# EAGLE design bike_sensor (EAGLE 9.6.1)
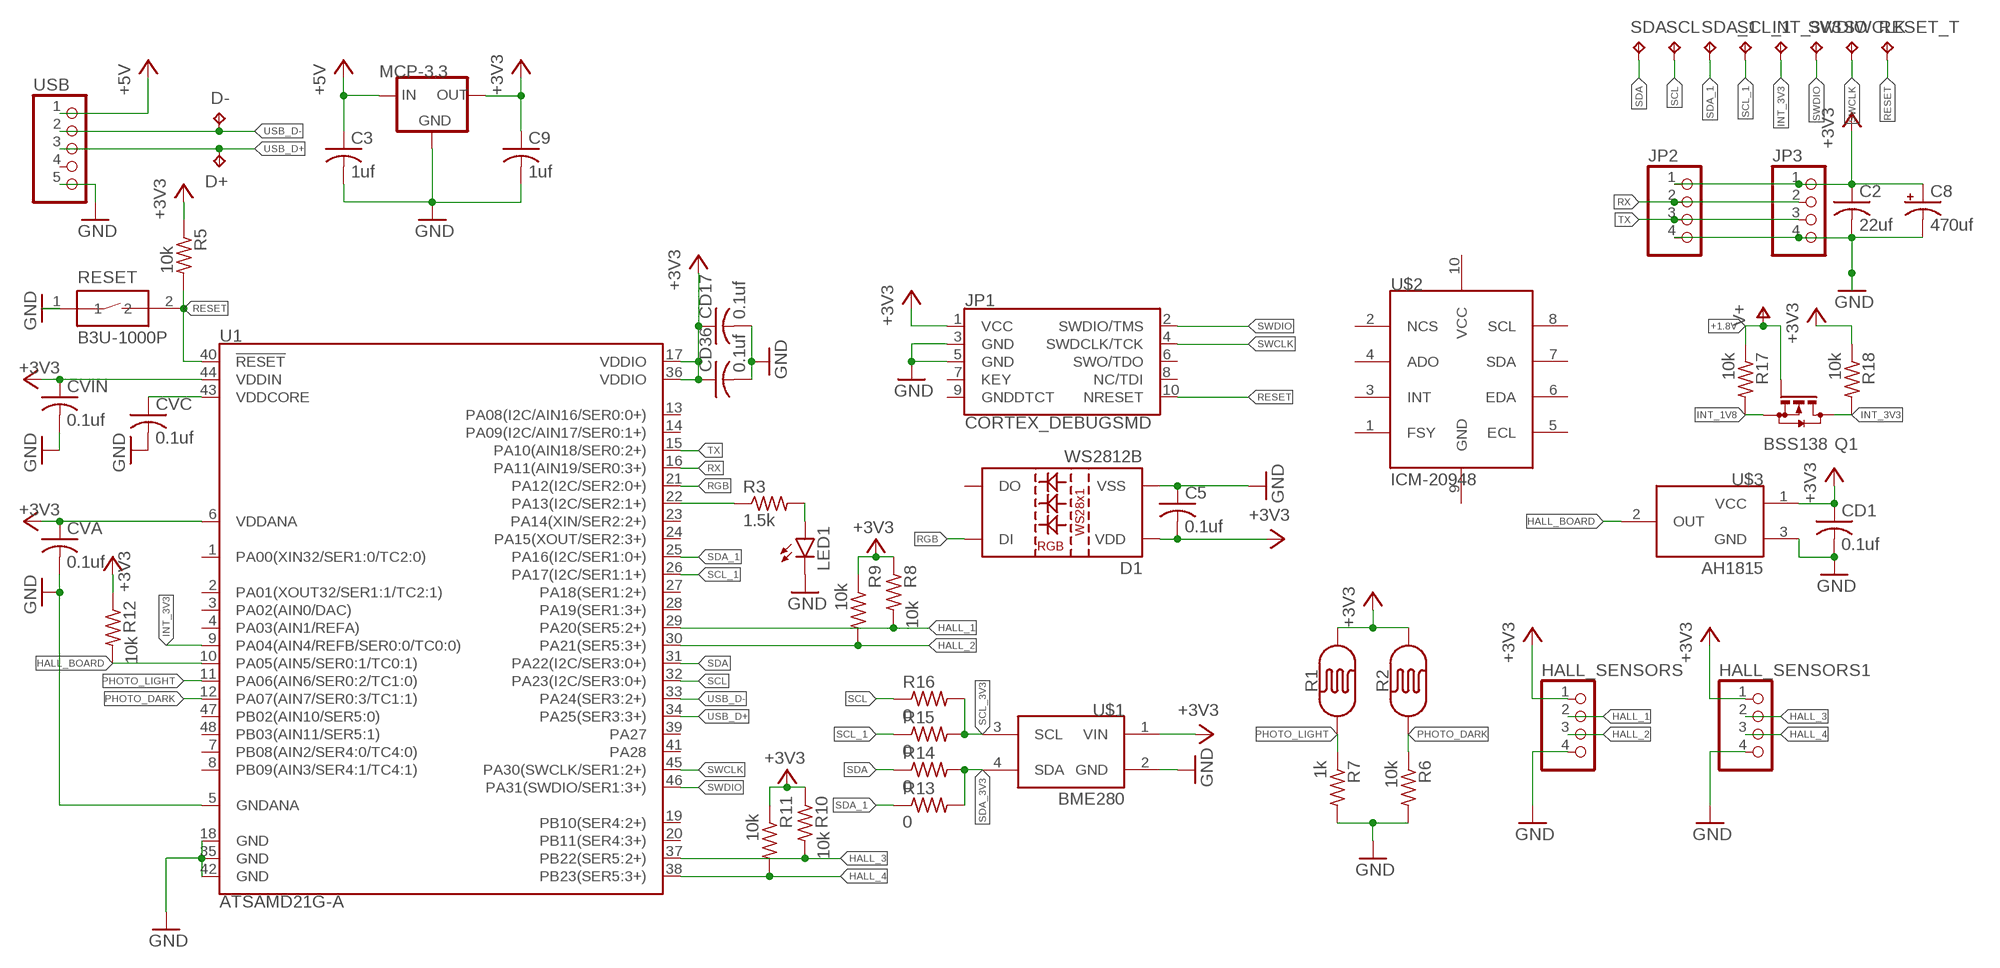
[diagram p0: schematic, sheet 1]

## Parts
C2  22uf  C-USC1210  [C1210]
C3  1uf  C-USC1210  [C1210]
C5  0.1uf  C-USC0805  [C0805]
C8  470uf  CPOL-USUD-8X10  [UD-8X10_NICHICON]
C9  1uf  C-USC1210  [C1210]
CD1  0.1uf  C-USC0805  [C0805]
CD17  0.1uf  C-USC0805  [C0805]
CD36  0.1uf  C-USC0805  [C0805]
CVA  0.1uf  C-USC0805  [C0805]
CVC  0.1uf  C-USC0805  [C0805]
CVIN  0.1uf  C-USC0805  [C0805]
D1  WS2812B  [WS2812B]
D+  TPB1,27  [B1,27]
D-  TPB1,27  [B1,27]
HALL_SENSORS  PINHD-1X4  [1X04]
HALL_SENSORS1  PINHD-1X4  [1X04]
INT_3V3  TPB1,27  [B1,27]
JP1  CORTEX_DEBUGSMD  [SAMTECH_FTSH-105-01]
JP2  PINHD-1X4  [1X04]
JP3  PINHD-1X4  [1X04]
LED1  LEDCHIPLED_0805  [CHIPLED_0805]
MCP-3.3  XC63FPM  [SOT23]
Q1  BSS138  BSS123  [SOT23]
R1  PHOTOCELLPTH  [PHOTOCELL]
R2  PHOTOCELLPTH  [PHOTOCELL]
R3  1.5k  R-US_R0805  [R0805]
R5  10k  R-US_R0805  [R0805]
R6  10k  R-US_R0805  [R0805]
R7  1k  R-US_R0805  [R0805]
R8  10k  R-US_R0805  [R0805]
R9  10k  R-US_R0805  [R0805]
R10  10k  R-US_R0805  [R0805]
R11  10k  R-US_R0805  [R0805]
R12  10k  R-US_R0805  [R0805]
R13  0  R-US_R0603  [R0603]
R14  0  R-US_R0603  [R0603]
R15  0  R-US_R0603  [R0603]
R16  0  R-US_R0603  [R0603]
R17  10k  R-US_R0805  [R0805]
R18  10k  R-US_R0805  [R0805]
RESET  B3U-1000P  [B3U-1000P]
RESET_T  TPB1,27  [B1,27]
SCL  TPB1,27  [B1,27]
SCL_1  TPB1,27  [B1,27]
SDA  TPB1,27  [B1,27]
SDA_1  TPB1,27  [B1,27]
SWCLK  TPB1,27  [B1,27]
SWDIO  TPB1,27  [B1,27]
U1  ATSAMD21G-A  [TQFP-48]
U$1  BMP280  [BME280-BOARD]
U$2  MPU9250  [ICM-20948-BOARD]
U$3  AH1815  [SOT23]
USB  PINHD-1X5  [1X05]

## Nets
+1.8V: Q1.1(G) R17.1 ; supply symbol labelled V+
+3V3: C2.1 C5.2 C8.+ C9.1 CD1.1 CD17.1 CD36.1 CVA.1 CVIN.1 D1.1(VDD) HALL_SENSORS1.1 HALL_SENSORS.1 JP1.1(VCC) JP2.1 JP3.1 MCP-3.3.2(OUT) R1.2 R2.2 R5.1 R8.1 R9.1 R10.1 R11.1 R12.1 R18.1 U1.6(VDDANA) U1.17(VDDIO) U1.36(VDDIO) U1.44(VDDIN) U$1.1(VIN) U$3.1(VCC)
+5V: C3.1 MCP-3.3.3(IN) USB.1
GND: C2.2 C3.2 C5.1 C8.- C9.2 CD1.2 CD17.2 CD36.2 CVA.2 CVC.2 CVIN.2 D1.3(VSS) HALL_SENSORS1.4 HALL_SENSORS.4 JP1.3(GND) JP1.5(GND) JP2.4 JP3.4 LED1.C MCP-3.3.1(GND) R6.2 R7.2 RESET.1 U1.5(GNDANA) U1.18(GND) U1.35(GND) U1.42(GND) U$1.2(GND) U$3.3(GND) USB.5
HALL_1: HALL_SENSORS.2 R8.2 U1.29(PA20(SER5:2+))
HALL_2: HALL_SENSORS.3 R9.2 U1.30(PA21(SER5:3+))
HALL_3: HALL_SENSORS1.2 R10.2 U1.37(PB22(SER5:2+))
HALL_4: HALL_SENSORS1.3 R11.2 U1.38(PB23(SER5:3+))
HALL_BOARD: R12.2 U1.10(PA05(AIN5/SER0:1/TC0:1)) U$3.2(OUT)
INT_1V8: Q1.2(S) R17.2
INT_3V3: INT_3V3.TP Q1.3(D) R18.2 U1.9(PA04(AIN4/REFB/SER0:0/TC0:0))
N$1: CVC.1 U1.43(VDDCORE)
N$2: R3.1 U1.22(PA13(I2C/SER2:1+))
N$3: LED1.A R3.2
PHOTO_DARK: R2.1 R6.1 U1.12(PA07(AIN7/SER0:3/TC1:1))
PHOTO_LIGHT: R1.1 R7.1 U1.11(PA06(AIN6/SER0:2/TC1:0))
RESET: JP1.10(NRESET) R5.2 RESET.2 RESET_T.TP U1.40(!RESET!)
RGB: D1.4(DI) U1.21(PA12(I2C/SER2:0+))
RX: JP2.2 JP3.2 U1.16(PA11(AIN19/SER0:3+))
SCL: R16.1 SCL.TP U1.32(PA23(I2C/SER3:0+))
SCL_1: R15.1 SCL_1.TP U1.26(PA17(I2C/SER1:1+))
SCL_3V3: R15.2 R16.2 U$1.3(SCL)
SDA: R14.1 SDA.TP U1.31(PA22(I2C/SER3:0+))
SDA_1: R13.1 SDA_1.TP U1.25(PA16(I2C/SER1:0+))
SDA_3V3: R13.2 R14.2 U$1.4(SDA)
SWCLK: JP1.4(SWDCLK/TCK) SWCLK.TP U1.45(PA30(SWCLK/SER1:2+))
SWDIO: JP1.2(SWDIO/TMS) SWDIO.TP U1.46(PA31(SWDIO/SER1:3+))
TX: JP2.3 JP3.3 U1.15(PA10(AIN18/SER0:2+))
USB_D+: D+.TP U1.34(PA25(SER3:3+)) USB.3
USB_D-: D-.TP U1.33(PA24(SER3:2+)) USB.2
Unconnected: D1.2(DO) JP1.6(SWO/TDO) JP1.7(KEY) JP1.8(NC/TDI) JP1.9(GNDDTCT) U1.1(PA00(XIN32/SER1:0/TC2:0)) U1.2(PA01(XOUT32/SER1:1/TC2:1)) U1.3(PA02(AIN0/DAC)) U1.4(PA03(AIN1/REFA)) U1.7(PB08(AIN2/SER4:0/TC4:0)) U1.8(PB09(AIN3/SER4:1/TC4:1)) U1.13(PA08(I2C/AIN16/SER0:0+)) U1.14(PA09(I2C/AIN17/SER0:1+)) U1.19(PB10(SER4:2+)) U1.20(PB11(SER4:3+)) U1.23(PA14(XIN/SER2:2+)) U1.24(PA15(XOUT/SER2:3+)) U1.27(PA18(SER1:2+)) U1.28(PA19(SER1:3+)) U1.39(PA27) U1.41(PA28) U1.47(PB02(AIN10/SER5:0)) U1.48(PB03(AIN11/SER5:1)) U$2.1(FSY) U$2.2(NCS) U$2.3(INT) U$2.4(ADO) U$2.5(ECL) U$2.6(EDA) U$2.7(SDA) U$2.8(SCL) U$2.9(GND) USB.4

## Power pins joined to a net without a drawn wire
VCC: U$2.10(VCC)

## Library data of the parts
C2 C3 C5 C9 CD1 CD17 CD36 CVA CVC CVIN = rcl:C-US: CAPACITOR, American symbol; SPICEPREFIX: C
C8 = rcl:CPOL-US: POLARIZED CAPACITOR, American symbol; SPICEPREFIX: C
D1 = SparkFun-LED:WS2812B: WS2812B SMD addressable RGB LED 5x5mm SMD LED with built-in controller IC. Color: Red/Green/Blue mC Rating: RGB: 390, 660, 180 mcd Forward Voltage: RGB: 2.0, 3.0, 3.0 V Packages:WS2812B SparkFun Products: Blynk Board - ESP8266 <https://www.sparkfun.com/products/13794>; PROD_ID: DIO-12503
D+ D- INT_3V3 RESET_T SCL SCL_1 SDA SDA_1 SWCLK SWDIO = testpad:TP: Test pad
HALL_SENSORS HALL_SENSORS1 JP2 JP3 = pinhead:PINHD-1X4: PIN HEADER
JP1 = CustomParts:CORTEX_DEBUG: Cortex Debug Connector Datasheet <http://infocenter.arm.com/help/topic/com.arm.doc.faqs/attached/13634/cortex_debug_connectors.pdf>
LED1 = led:LED: LED OSRAM: - CHIPLED LG R971, LG N971, LY N971, LG Q971, LY Q971, LO R971, LY R971 LH N974, LH R974 LS Q976, LO Q976, LY Q976 LO Q996 - Hyper CHIPLED LW Q18S LB Q993, LB Q99A, LB R99A - SideLED LS A670, LO A670, LY A670, LG A670, LP A670 LB A673, LV A673, LT A673, LW A673 LH A674 LY A675 LS A676, LA A676, LO A676, LY A676, LW A676 LS A679, LY A679, LG A679 - Hyper Micro SIDELED® LS Y876, LA Y876, LO Y876, LY Y876 LT Y87S - SmartLED LW L88C, LW L88S LB L89C, LB L89S, LG L890 LS L89K, LO L89K, LY L89K LS L896, LA L896, LO L896, LY L896 - TOPLED LS T670, LO T670, LY T670, LG T670, LP T670 LSG T670, LSP T670, LSY T670, LOP T670, LYG T670 LG T671, LOG T671, LSG T671 LB T673, LV T673, LT T673, LW T673 LH T674 LS T676, LA T676, LO T676, LY T676, LB T676, LH T676, LSB T676, LW T676 LB T67C, LV T67C, LT T67C, LS T67K, LO T67K, LY T67K, LW E67C LS E67B, LA E67B, LO E67B, LY E67B, LB E67C, LV E67C, LT E67C LW T67C LS T679, LY T679, LG T679 LS T770, LO T770, LY T770, LG T770, LP T770 LB T773, LV T773, LT T773, LW T773 LH T774 LS E675, LA E675, LY E675, LS T675 LS T776, LA T776, LO T776, LY T776, LB T776 LHGB T686 LT T68C, LB T68C - Hyper Mini TOPLED® LB M676 - Mini TOPLED Santana® LG M470 LS M47K, LO M47K, LY M47K Source: http://www.osram.convergy.de LUXEON: - LUMILED® LXK2-PW12-R00, LXK2-PW12-S00, LXK2-PW14-U00, LXK2-PW14-V00 LXK2-PM12-R00, LXK2-PM12-S00, LXK2-PM14-U00 LXK2-PE12-Q00, LXK2-PE12-R00, LXK2-PE12-S00, LXK2-PE14-T00, LXK2-PE14-U00 LXK2-PB12-K00, LXK2-PB12-L00, LXK2-PB12-M00, LXK2-PB14-N00, LXK2-PB14-P00, LXK2-PB14-Q00 LXK2-PR12-L00, LXK2-PR12-M00, LXK2-PR14-Q00, LXK2-PR14-R00 LXK2-PD12-Q00, LXK2-PD12-R00, LXK2-PD12-S00 LXK2-PH12-R00, LXK2-PH12-S00 LXK2-PL12-P00, LXK2-PL12-Q00, LXK2-PL12-R00 Source: www.luxeon.com KINGBRIGHT: KA-3528ASYC Source: www.kingbright.com
MCP-3.3 = v-reg:XC63FP: Positiv Voltage Regulators www.torex.co.jp/english/product/pro02/pdf/0201_xc62fp.pdf
Q1 = transistor-small-signal:BSS123: N-CHANNEL MOS FET
R1 R2 = SparkFun-Sensors:PHOTOCELL: Photocell (Photodetector, Photo Resistor, CdS) This is a very small light sensor. A photocell changes (also called a photodetector, photo resistor, CdS or photoconductive cell) resistance depending on the amount of light it is exposed to. These little sensors make great ambient light triggers (when light in the room turns on, do something). Datasheet <http://cdn.sparkfun.com/datasheets/Sensors/LightImaging/SEN-09088.pdf> SparkFun Products Mini Photocell <https://www.sparkfun.com/products/9088> (SEN-09088); PROD_ID: COMP-09129; SF_ID: SEN-09088
R3 R5-R18 = rcl:R-US_: RESISTOR, American symbol; SPICEPREFIX: R
RESET = Switch:B3U-1000P: SWITCH TACTILE SPST-NO 0.05A 12V Manufacturer's datasheet <https://omronfs.omron.com/en_US/ecb/products/pdf/en-b3u.pdf>; CREATED_BY: PCBLayout.com; DIGI_KEY_PART_NUMBER: SW1020CT-ND; MANUFACTURER: Omron Electronics Inc-EMC Div; MPN: B3U-1000P; PACKAGE: SPST-NO
U1 = CustomParts:ATSAMD21G: Atmel SAMD21G SMART ARM-Based Microcontroller The Atmel ® | SMART ™ SAM D21 is a series of low-power microcontrollers using the 32-bit ARM ® Cortex ® -M0+ processor, and ranging from 32- to 64-pins with up to 256KB Flash and 32KB of SRAM. The SAM D21 devices operate at a maximum frequency of 48MHz and reach 2.46 CoreMark/MHz. They are designed for simple and intuitive migration with identical peripheral modules, hex compatible code, identical linear address map and pin compatible migration paths between all devices in the product series. All devices include intelligent and flexible peripherals, Atmel Event System for inter-peripheral signaling, and support for capacitive touch button, slider and wheel user interfaces.; PROD_ID: IC-13064
U$1 = CustomParts:BMP280
U$2 = CustomParts:MPU9250
U$3 = CustomParts:AH1815: Hall sensor AH1815 Non-latching
USB = pinhead:PINHD-1X5: PIN HEADER

## Board
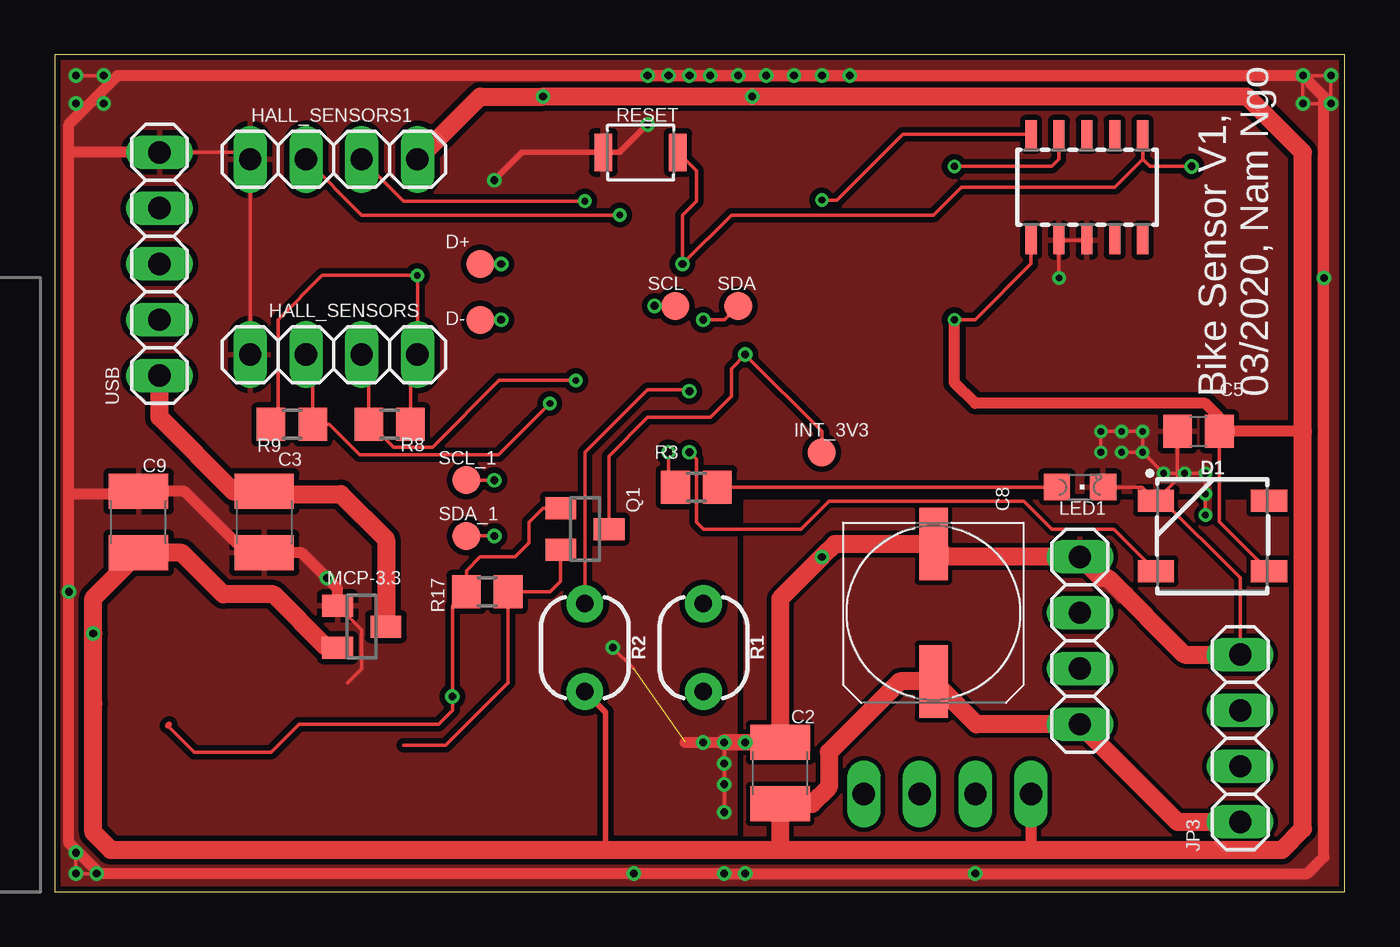
[diagram p1: board, top side]
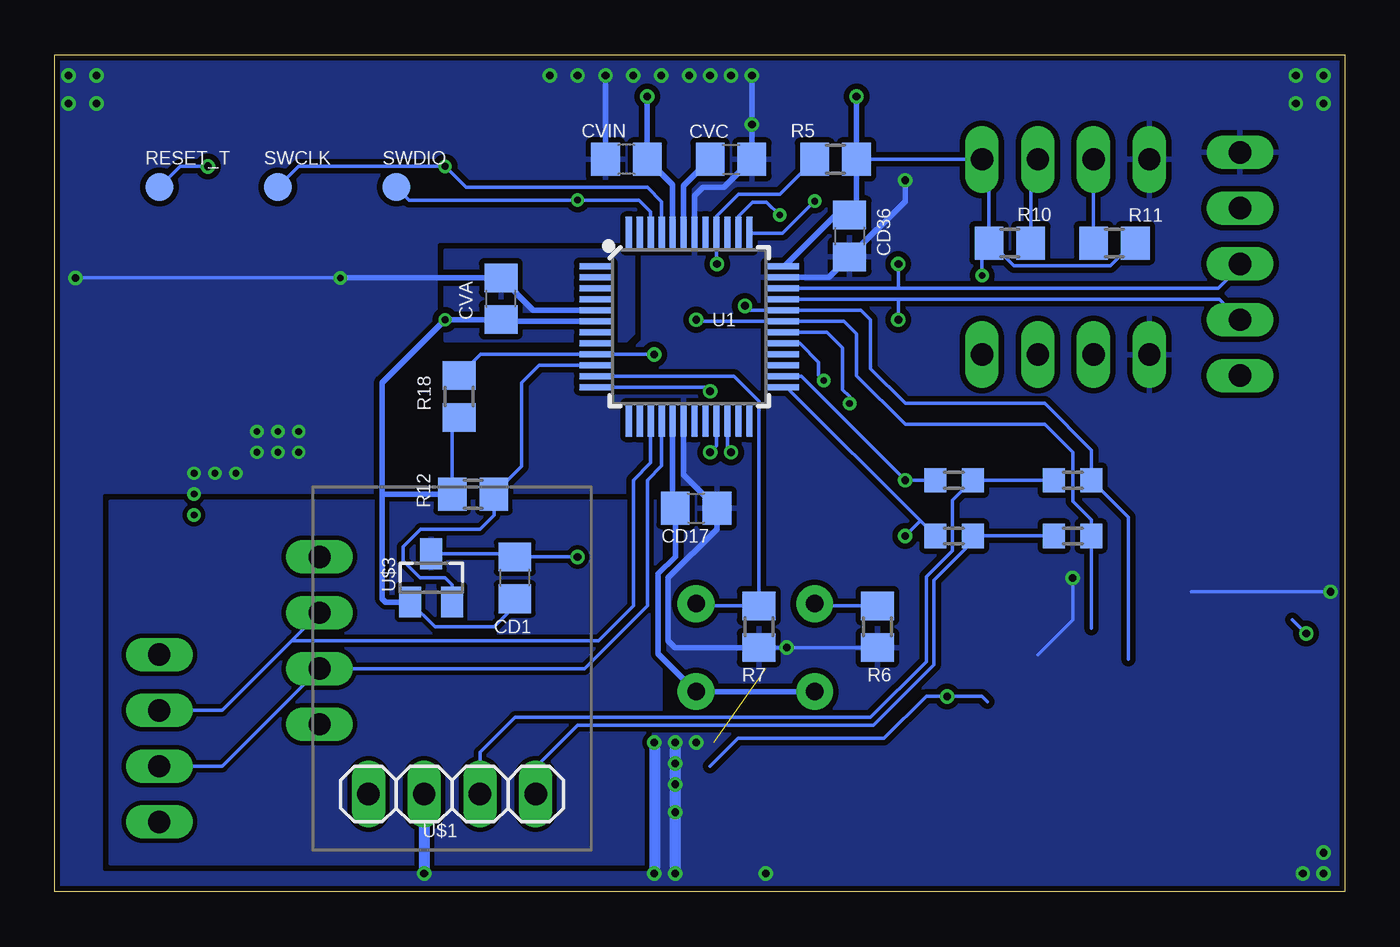
[diagram p2: board, bottom side, seen from below]

Size 58.73 x 38.09 mm. Coordinates in mm from the lower left corner, seen from the top.
Outline: 0,0 58.73,0 58.73,38.09 0,38.09 0,0
Copper layers (1*16): Top 0.035mm / dielectric 1.5mm / Bottom 0.035mm
Design rules "dirt_cheap_dirty_boards.v1.1": minimum track width 6mil, minimum drill 12mil, track to track 6mil, track to pad 6mil, pad to pad 6mil, via to via 6mil, smd to smd 0mil, copper to edge 10mil, drill to drill 10mil, minimum pad ring 10mil, minimum via ring 6mil, stop-mask expansion 2mil, vias tented up to drill 25mil, thermal gap 10mil

### Footprints (pad centres in the part's own frame; a part is rotated, then mirrored left to right if it is on the bottom)
C1210 = smd 1.6 x 2.7: 1 -1.4,0; 2 1.4,0
C0805 = smd 1.3 x 1.5: 1 -0.95,0; 2 0.95,0
UD-8X10_NICHICON = smd 3.3 x 1.3: + 3.125,0; - -3.125,0
WS2812B = smd 1.651 x 1: 1 2.577,-1.6; 2 2.577,1.6; 3 -2.577,1.6; 4 -2.577,-1.6
B1,27 = smd 1.27 x 1.27: TP 0,0
1X04 = drill 1.016 long: 1 -3.81,0; 2 -1.27,0; 3 1.27,0; 4 3.81,0
SAMTECH_FTSH-105-01 = smd 0.508 x 1.27: 1 -2.54,-2.413; 2 -2.54,2.413; 3 -1.27,-2.413; 4 -1.27,2.413; 5 0,-2.413; 6 0,2.413; 7 1.27,-2.413; 8 1.27,2.413; 9 2.54,-2.413; 10 2.54,2.413
CHIPLED_0805 = smd 1.2 x 1.2: A 0,-1.05; C 0,1.05
SOT23 = smd 1 x 1.4: 1 -0.95,-1.1; 2 0.95,-1.1; 3 0,1.1
PHOTOCELL = drill 0.8 pad 1.676: 1 -2,0; 2 2,0
R0805 = smd 1.3 x 1.5: 1 -0.95,0; 2 0.95,0
R0603 = smd 1 x 1.1: 1 -0.85,0; 2 0.85,0
B3U-1000P = smd 0.8 x 1.7: 1 -1.7,0; 2 1.7,0
TQFP-48 = smd 1.5 x 0.28: 1 -4.25,2.75; 2 -4.25,2.25; 3 -4.25,1.75; 4 -4.25,1.25; 5 -4.25,0.75; 6 -4.25,0.25; 7 -4.25,-0.25; 8 -4.25,-0.75; 9 -4.25,-1.25; 10 -4.25,-1.75; 11 -4.25,-2.25; 12 -4.25,-2.75; 25 4.25,-2.75; 26 4.25,-2.25; 27 4.25,-1.75; 28 4.25,-1.25; 29 4.25,-0.75; 30 4.25,-0.25; 31 4.25,0.25; 32 4.25,0.75; 33 4.25,1.25; 34 4.25,1.75; 35 4.25,2.25; 36 4.25,2.75 | smd 0.28 x 1.5: 13 -2.75,-4.25; 14 -2.25,-4.25; 15 -1.75,-4.25; 16 -1.25,-4.25; 17 -0.75,-4.25; 18 -0.25,-4.25; 19 0.25,-4.25; 20 0.75,-4.25; 21 1.25,-4.25; 22 1.75,-4.25; 23 2.25,-4.25; 24 2.75,-4.25; 37 2.75,4.25; 38 2.25,4.25; 39 1.75,4.25; 40 1.25,4.25; 41 0.75,4.25; 42 0.25,4.25; 43 -0.25,4.25; 44 -0.75,4.25; 45 -1.25,4.25; 46 -1.75,4.25; 47 -2.25,4.25; 48 -2.75,4.25
BME280-BOARD = drill 1.016 long: 1 -6.35,3.81; 2 -6.35,1.27; 3 -6.35,-1.27; 4 -6.35,-3.81
ICM-20948-BOARD = drill 1.016 long: 1 0,-11.43; 2 0,-8.89; 3 0,-6.35; 4 0,-3.81; 5 0,-1.27; 6 0,1.27; 7 0,3.81; 8 0,6.35; 9 0,8.89; 10 0,11.43
1X05 = drill 1.016 long: 1 -5.08,0; 2 -2.54,0; 3 0,0; 4 2.54,0; 5 5.08,0

### Placement (x,y rotation side)
C2  33.02,5.4 90 top
C3  9.53,16.83 270 top
C5  52.07,20.96 0 top
C8  40.01,12.7 270 top
C9  3.81,16.83 90 top
CD1  37.78,14.29 90 bottom
CD17  29.53,17.46 0 bottom
CD36  22.54,29.85 270 bottom
CVA  38.42,26.99 90 bottom
CVC  27.94,33.34 0 bottom
CVIN  32.7,33.34 180 bottom
D1  52.7,16.19 0 top
D+  19.37,28.57 0 top
D-  19.37,26.04 0 top
HALL_SENSORS  12.7,24.45 180 top
HALL_SENSORS1  12.7,33.34 180 top
INT_3V3  34.93,20 0 top
JP1  46.99,32.07 0 top
JP2  46.67,11.43 90 top
JP3  53.98,6.98 90 top
LED1  46.67,18.42 270 top
MCP-3.3  13.97,12.07 270 top
Q1  24.13,16.51 270 top
R1  29.53,11.11 270 top
R2  24.13,11.11 270 top
R3  29.21,18.42 0 top
R5  23.18,33.34 180 bottom
R6  21.27,12.07 270 bottom
R7  26.67,12.07 270 bottom
R8  15.24,21.27 180 top
R9  10.79,21.27 0 top
R10  15.24,29.53 0 bottom
R11  10.48,29.53 180 bottom
R12  39.69,18.1 0 bottom
R13  17.78,16.19 0 bottom
R14  12.38,16.19 180 bottom
R15  17.78,18.73 0 bottom
R16  12.38,18.73 180 bottom
R17  19.69,13.65 0 top
R18  40.32,22.54 90 bottom
RESET  26.67,33.66 0 top
RESET_T  53.98,32.07 0 bottom
SCL  28.26,26.67 0 top
SCL_1  18.73,18.73 0 top
SDA  31.12,26.67 0 top
SDA_1  18.73,16.19 0 top
SWCLK  48.58,32.07 0 bottom
SWDIO  43.18,32.07 0 bottom
U1  29.85,25.72 0 bottom
U$1  40.64,10.79 90 bottom
U$2  -14.61,13.97 0 top  (outside the outline)
U$3  41.59,14.29 0 bottom
USB  4.76,28.57 90 top

### Tracks (layer width: path | path; a pad name or v marks a point on that pad's centre or on a via)
+1.8V  (via drill 0.35)
  Top 0.152: 5.15,7.55 6.35,6.35 9.84,6.35 11.11,7.62 17.46,7.62 18.1,8.25 v18.1,8.89 18.1,13.02 R17.1 18.73,14.61 19.37,15.24 20.96,15.24 21.59,15.87 21.59,16.83 22.22,17.46 Q1.1
  Top 0.254: 5.21,7.62 5.15,7.55
  Bottom 0.152: 28.89,5.71 27.63,6.98 20.96,6.98 19.05,8.89 v18.1,8.89 16.51,8.89 16.26,8.64
+3V3  (via drill 0.3, 0.35)
  Top 0.152: R8.1 16.19,24.13 HALL_SENSORS.1 v16.51,28.05 12.18,28.05 10.16,26.04 10.16,21.59 R9.1 | C5.2 53.02,16.85 D1.1 | v40.96,26.04 41.91,26.04 44.45,28.57 JP1.1
  Top 0.254: R2.2 25.08,8.16 25.08,1.91
  Top 0.508: MCP-3.3.2 12.38,11.11 | U$1.1 44.45,1.91 | 56.83,20.96 C5.2 | C5.2 53.02,21.59 52.39,22.22 41.91,22.22 40.96,23.18 v40.96,26.04
  Top 0.813: JP3.1 51.12,3.18 JP2.1 41.96,7.62 C8.+ 38.47,9.57 35.24,6.35 35.24,4.76 34.48,4 C2.1 33.02,1.91 | HALL_SENSORS1.1 19.37,36.19 v22.23,36.19 v31.75,36.19 54.29,36.19 56.83,33.65 56.83,20.96 56.83,2.86 55.88,1.91 44.45,1.91 33.02,1.91 | 33.02,1.91 25.08,1.91 2.54,1.91 1.75,2.7 1.75,8.57 v1.75,11.75 1.75,13.36 C9.1 5.78,15.43 7.67,13.54 9.96,13.54 12.38,11.11
  Bottom 0.152: 38.35,25.97 CVA.1 | U1.36 25.51,28.47 | U$3.1 41.42,12.07 38.73,12.07 37.78,13.02 CD1.1 | 22.23,31.11 CD36.1 | R10.1 16.19,33.02 HALL_SENSORS1.1 R5.1 | R11.1 9.63,29.53 10.66,28.5 15.06,28.5 16.09,29.53 R10.1 | v16.51,28.05 16.51,29.21 R10.1 | v1.75,11.75 2.38,12.38 | R12.1 40.64,21.28 R18.1
  Bottom 0.254: U1.17 30.6,17.58 CD17.1 30.48,15.25 31.26,14.48 31.26,10.84 R1.2 R2.2 | U1.6 38.35,25.97 | CD36.1 23.18,30.79 25.51,28.47 | U1.44 30.6,32.18 CVIN.1 v31.75,36.19 | 43.81,18.1 43.81,13.34 43.67,13.19 U$3.1 | CVA.1 v40.96,26.04 43.81,23.18 43.81,18.1 | R12.1 43.81,18.1 | 22.23,31.11 R5.1 v22.23,36.19
+5V
  Top 0.508: C3.1 9.65,18.1
  Top 0.813: 9.65,18.1 13.02,18.1 15.07,16.04 MCP-3.3.3 | USB.1 4.76,21.59 8.12,18.23 C3.1
AGND
  pour Bottom (isolate 0.254): 32.38,29.21 40.96,29.21 40.96,25.08 32.7,25.08 32.38,25.4
GND  (via drill 0.3, 0.35)  (1 unrouted)
  Top 0.152: HALL_SENSORS.4 HALL_SENSORS1.4 8.57,33.65 USB.5 | C5.1 51.12,19.05 | 51.12,19.05 51.12,18.78 50.3,17.96 | 50.3,17.96 D1.3 49.51,18.42 LED1.C | JP3.4 53.98,14.29 50.3,17.96 | v45.72,27.94 JP1.3 JP1.5 | MCP-3.3.1 13.97,11.91 13.97,10.16 13.33,9.52 | v32.38,37.15 v31.12,37.15 | v36.2,37.15 v34.93,37.15 | v1.91,0.83 v0.95,0.83 v0.95,1.78 0.64,2.1 0.64,2.22 | v56.83,37.15 v56.83,35.88 v58.1,35.88 v58.1,37.15 v56.83,37.15 | v56.83,37.15 57.15,36.83 | v0.95,37.15 v2.22,37.15 2.22,36.51 v2.22,35.88 v0.95,35.88 | v47.62,20 v47.62,20.96 v48.58,20.96 v49.53,20.96 v49.53,20 | v49.53,20 v48.58,20 | v49.53,20 v50.48,19.05 51.12,19.05 | 51.12,19.05 v51.44,19.05 v52.39,19.05 v52.39,18.1 v52.39,17.14 | v30.48,6.79 30.48,6.67 | 30.48,6.67 v30.48,5.84 v30.48,4.89 v30.48,3.62 | v29.53,6.79 30.35,6.79 30.48,6.67 | v25.4,11.11 26.35,10.16
  Top 0.254: v26.99,34.93 25.72,33.65 RESET.1 21.27,33.65 v20,32.39
  Top 0.508: 57.15,36.83 57.79,36.19 v57.79,27.94 57.79,1.59 57.02,0.83 v41.91,0.83 v31.43,0.83 v30.48,0.83 v26.35,0.83 2.03,0.83 0.64,2.22 v0.64,13.65 0.64,18.1 | v56.83,37.15 v34.93,37.15 v33.66,37.15 v31.12,37.15 v29.85,37.15 v28.89,37.15 v27.94,37.15 v26.99,37.15 2.86,37.15 2.22,36.51 0.64,34.93 0.64,33.65 | v30.48,6.79 v30.48,6.8 28.71,6.8 | 0.64,18.1 0.64,33.65 | USB.5 0.64,33.65 | MCP-3.3.1 12.87,13.8 v12.38,14.29 11.24,15.43 C3.2 8.7,15.43 5.9,18.23 C9.2 3.68,18.1 0.64,18.1
  Top 0.762: C2.2 v31.43,6.8 v30.48,6.8
  Top 0.813: JP3.4 51.44,10.79 47.94,14.29 47.62,14.29 JP2.4 40.59,15.24 C8.- 35.51,15.82 v34.93,15.24 33.02,13.34 C2.2
  Bottom 0.152: U$3.3 37.93,15.39 CD1.2 v34.93,15.24 | CVA.2 | 27.1,33.34 CVC.2 | R7.2 v25.4,11.11 R6.2 | 13.97,10.79 12.38,12.38 v12.38,14.29 | 6.98,13.65 v0.64,13.65 | v45.72,27.94 v57.79,27.94
  Bottom 0.254: U1.35 23.47,27.97 CD36.2 20,31.43 v20,32.39 | U1.18 30.1,18.98 CD17.2 28.58,16.51 30.8,14.29 30.8,11.43 30.48,11.11 R7.2 | U1.5 36.95,26.47 CVA.2 | CVC.2 28.26,32.07 29.21,32.07 29.6,31.68 U1.42 | CVA.2 v45.72,27.94 | v26.99,37.15 v26.99,34.93 26.99,33.44 27.1,33.34 | v33.66,37.15 CVIN.2
  Bottom 0.508: v30.48,6.79 v30.48,0.83 | v31.43,6.8 v31.43,0.83 | U$1.2 v41.91,0.83
  pour Top (isolate 0.254, rank 6): 0,38.1 58.74,38.1 58.74,0 0,0
  pour Bottom (isolate 0.254, rank 6): 0,38.1 58.74,38.1 58.74,0 0,0
GND_PW_B
  pour Top (isolate 0.203): 56.2,17.78 31.43,17.78 31.43,1.59 56.2,1.59
  pour Bottom (isolate 0.203, rank 3): 56.2,17.78 31.12,17.78 31.12,1.27 56.2,1.27
HALL_1  (via drill 0.3)
  Top 0.152: HALL_SENSORS.2 14.29,24.13 R8.2 14.39,21.27 15.42,20.24 17.19,20.24 20.22,23.27 v23.72,23.27
  Bottom 0.152: v23.72,23.27 23.95,23.51 23.95,24.11 24.81,24.97 U1.29
HALL_2  (via drill 0.3)
  Top 0.152: HALL_SENSORS.3 11.74,24.13 R9.2 12.49,21.27 13.88,19.89 20.21,19.89 v22.54,22.22
  Bottom 0.152: v22.54,22.22 22.54,22.54 22.86,22.86 22.86,24.76 23.56,25.47 U1.30
HALL_3  (via drill 0.3)
  Top 0.152: HALL_SENSORS1.2 15.88,31.43 v24.13,31.43
  Bottom 0.152: HALL_SENSORS1.2 14.29,33.02 R10.2 | v24.13,31.43 25.6,29.97 U1.37
HALL_4  (via drill 0.3)
  Top 0.152: HALL_SENSORS1.3 13.97,30.8 v25.72,30.8
  Bottom 0.152: HALL_SENSORS1.3 R11.2 | v25.72,30.8 26.31,31.39 26.95,31.39 27.6,30.75 U1.38
HALL_BOARD
  Bottom 0.152: U$3.2 40.64,13.97 40.96,14.29 42.09,14.29 42.86,15.06 42.86,15.71 42.06,16.51 39.37,16.51 38.74,17.14 R12.2 37.47,19.37 37.47,23.18 36.68,23.97 U1.10
INT_1V8
  Top 0.152: 15.88,6.67 17.78,6.67 20.64,9.52 R17.2 22.54,13.65 23.03,14.14 Q1.2
INT_3V3  (via drill 0.35)
  Top 0.152: Q1.3 25.23,19.83 26.99,21.59 29.85,21.59 30.8,22.54 30.8,23.81 v31.43,24.45 34.93,20.96 INT_3V3.TP
  Bottom 0.152: v31.43,24.45 31.45,24.47 U1.9 39.35,24.47 R18.2
N$1
  Bottom 0.254: CVC.1 30.1,32.13 U1.43
N$2  (via drill 0.35)
  Top 0.152: v27.94,20 27.94,18.74 R3.1
  Bottom 0.152: U1.22 28.1,20.16 v27.94,20
N$3
  Top 0.152: R3.2 LED1.A
PHOTO_DARK  (via drill 0.35)
  Top 0.152: R2.1 24.13,20 26.99,22.86 28.81,22.86 v28.89,22.78
  Bottom 0.152: R2.1 24.03,13.02 R6.1 | v28.89,22.78 29.08,22.97 U1.12
PHOTO_LIGHT
  Bottom 0.152: R1.1 29.43,13.02 R7.1 26.67,22.33 27.81,23.47 U1.11
RESET  (via drill 0.35)
  Top 0.152: RESET.2 29.21,32.82 29.21,31.43 28.58,30.8 v28.58,28.57 30.8,30.8 40.01,30.8 41.27,32.07 48.26,32.07 49.53,33.34 | JP1.10 49.53,33.34 | 49.53,33.34 49.85,33.02 v51.75,33.02
  Bottom 0.152: v28.58,28.57 28.6,28.6 U1.40 28.6,30.75 27.6,31.75 25.71,31.75 R5.2 | v51.75,33.02 53.02,33.02 RESET_T.TP
RGB  (via drill 0.35)
  Top 0.152: D1.4 48.21,16.51 45.4,16.51 44.13,17.78 35.24,17.78 33.97,16.51 29.53,16.51 29.21,16.83 29.21,19.68 v28.89,20
  Bottom 0.152: v28.89,20 28.6,20.3 U1.21
RX
  Bottom 0.152: JP3.2 51.12,5.71 JP2.2 34.61,10.16 31.75,13.02 31.75,18.73 31.1,19.39 U1.16
SCL  (via drill 0.35)
  Top 0.152: v27.3,26.67 SCL.TP
  Bottom 0.152: 9.84,10.58 9.84,17.04 R16.1 11.53,20.11 13.65,22.22 20,22.22 21.59,23.81 21.59,26.04 22.02,26.47 U1.32 27.1,26.47 v27.3,26.67
SCL_1  (via drill 0.35)
  Top 0.152: SCL_1.TP v20,18.73
  Bottom 0.152: U1.26 24.74,23.47 v20,18.73 R15.1
SCL_3V3
  Bottom 0.152: U$1.3 39.37,6.35 37.78,7.94 21.59,7.94 19.05,10.48 19.05,14.33 17.85,15.53 17.85,17.81 R15.2 R16.2
SDA  (via drill 0.35)
  Top 0.152: v29.53,26.04 30.48,26.04 SDA.TP
  Bottom 0.152: 11.53,11.99 R14.1 11.53,16.93 12.38,17.78 12.38,20 13.65,21.27 20,21.27 22.23,23.5 22.23,25.4 22.79,25.97 U1.31 29.46,25.97 v29.53,26.04
SDA_1  (via drill 0.35)
  Top 0.152: SDA_1.TP v20,16.19
  Bottom 0.152: R13.1 19.32,16.88 | 19.32,16.88 25.41,22.97 U1.25 | v20,16.19 19.32,16.88
SDA_3V3
  Bottom 0.152: U$1.4 36.83,5.68 34.93,7.58 21.44,7.58 18.69,10.33 18.69,14.18 16.93,15.94 R13.2 R14.2
SWCLK  (via drill 0.3)
  Top 0.152: v40.96,33.02 45.4,33.02 45.72,33.34 JP1.4
  Bottom 0.152: U1.45 31.1,31.41 31.75,32.07 40.01,32.07 v40.96,33.02 47.62,33.02 SWCLK.TP
SWDIO  (via drill 0.3)
  Top 0.152: v34.93,31.48 35.61,31.48 38.61,34.48 JP1.2
  Bottom 0.152: U1.46 31.6,30.96 32.12,31.48 v34.93,31.48 42.6,31.48 SWDIO.TP
TX
  Bottom 0.152: JP3.3 51.12,8.25 47.94,11.43 | 47.94,11.43 JP2.3 | 47.94,11.43 33.97,11.43 32.38,13.02 32.38,18.73 31.6,19.52 U1.15
USB_D+  (via drill 0.35)
  Top 0.152: D+.TP v20.32,28.57
  Bottom 0.152: U1.34 20.32,27.47 | 20.32,27.47 5.74,27.47 4.76,28.45 USB.3 | v20.32,28.57 20.32,27.47
USB_D-  (via drill 0.35)
  Top 0.152: D-.TP v20.32,26.04
  Bottom 0.152: U1.33 20.32,26.97 | 20.32,26.97 5.7,26.97 USB.2 | v20.32,26.04 20.32,26.97

### Text on the board
tPlace: Bike Sensor V1, / 03/2020, Nam Ngo
tDocu: 2 | GND | 3v3 | GND | 1 VCC | 3v3 | GND | GND | TX | GND | RX | TX | 3v3 | RX | 3v3 | SDA | SCL | 1V8 | SDA | SCL | 3v3 | GND | GND